# EAGLE schematic msp430f5528 (EAGLE 6.6.0)
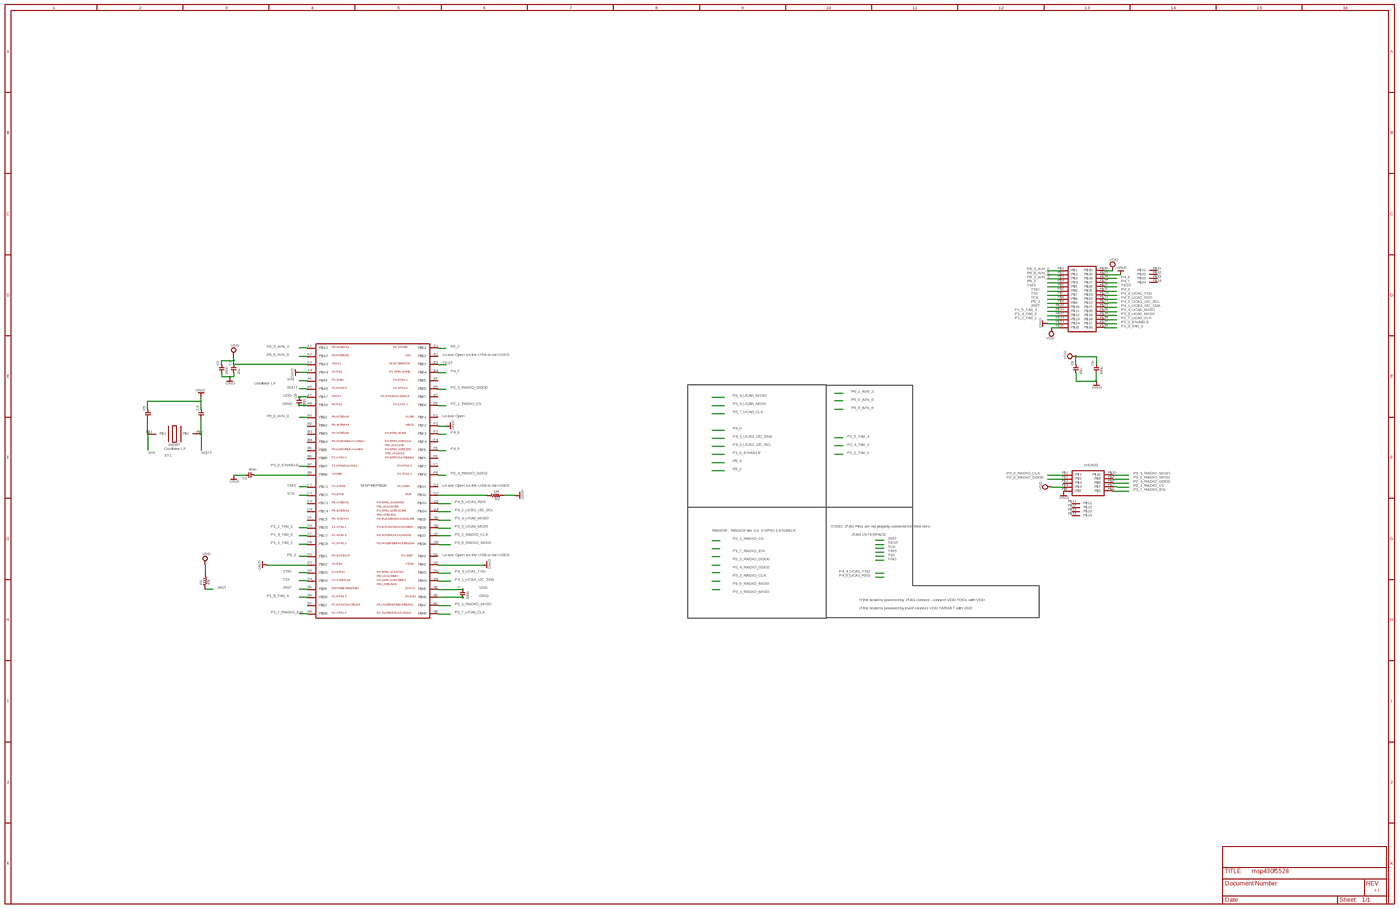
[diagram p0: schematic, sheet 1, overview]
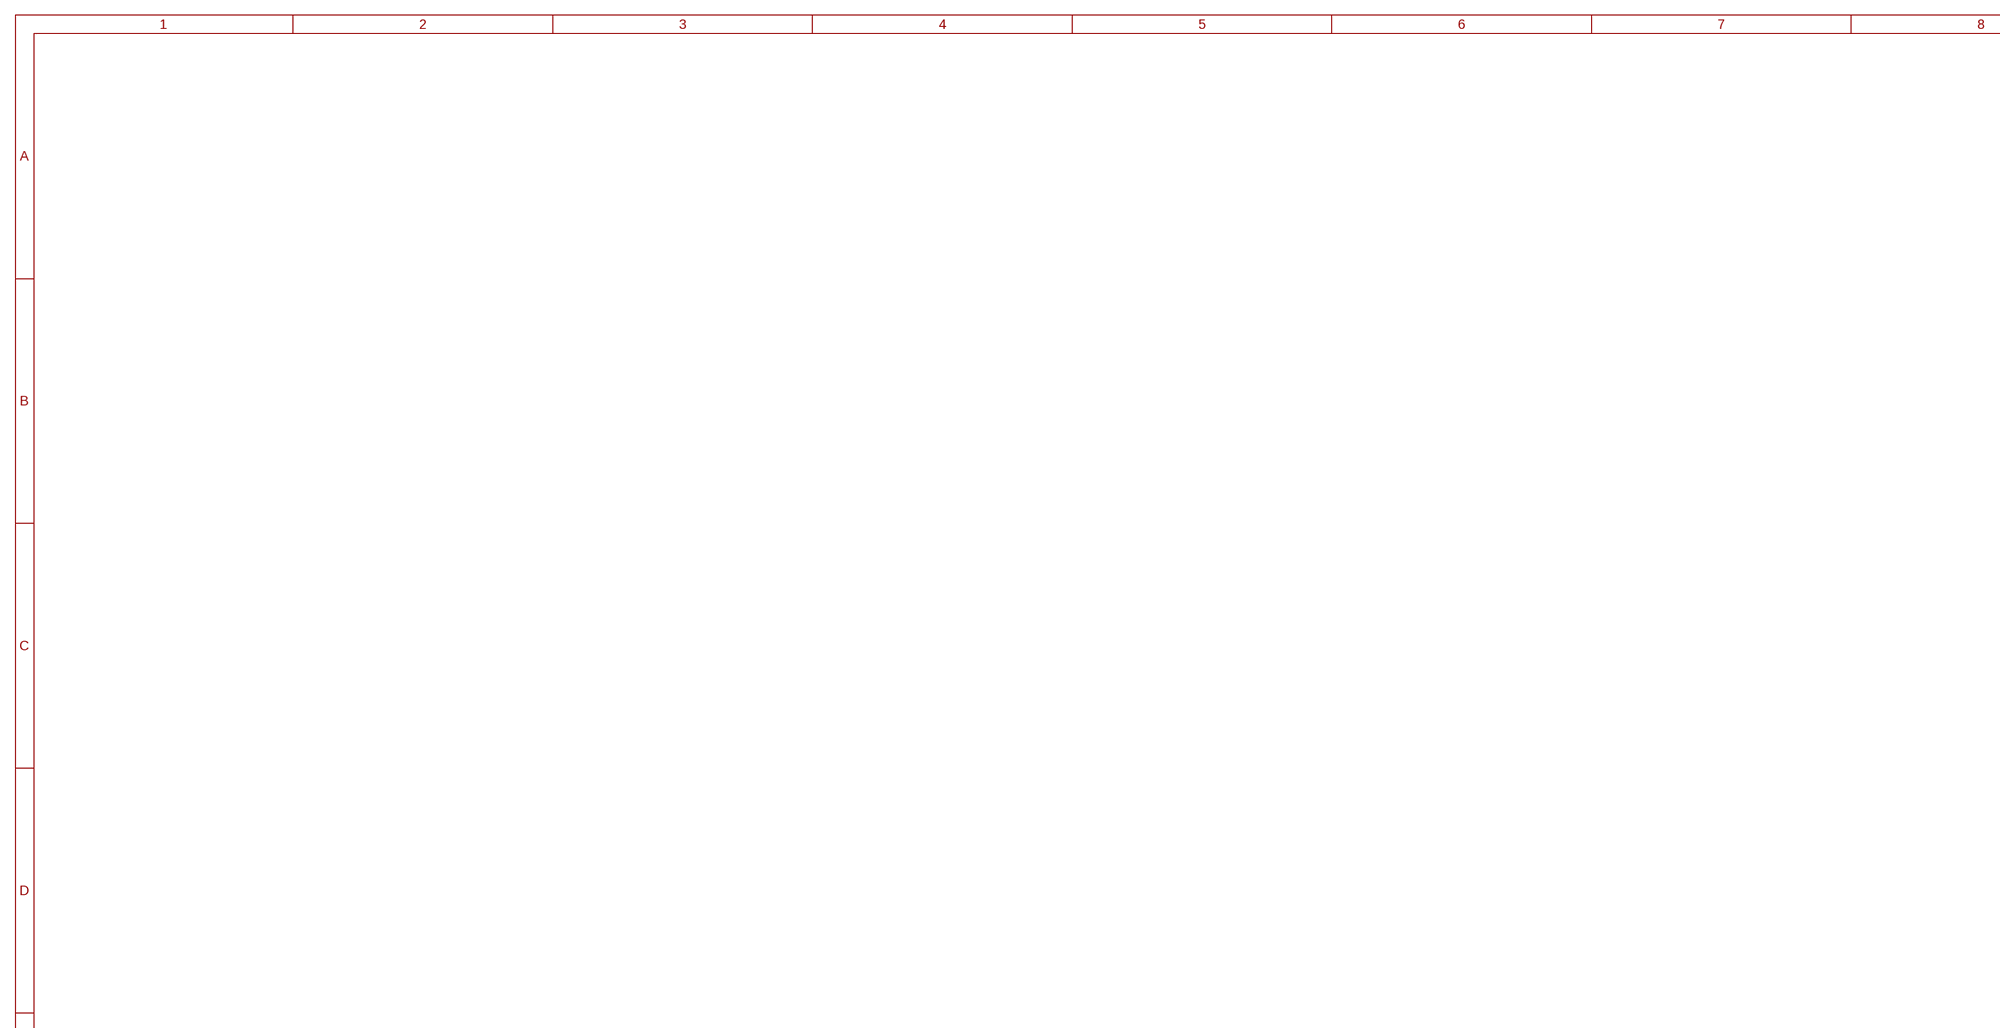
[diagram p1: schematic, sheet 1, part 1 of 4]
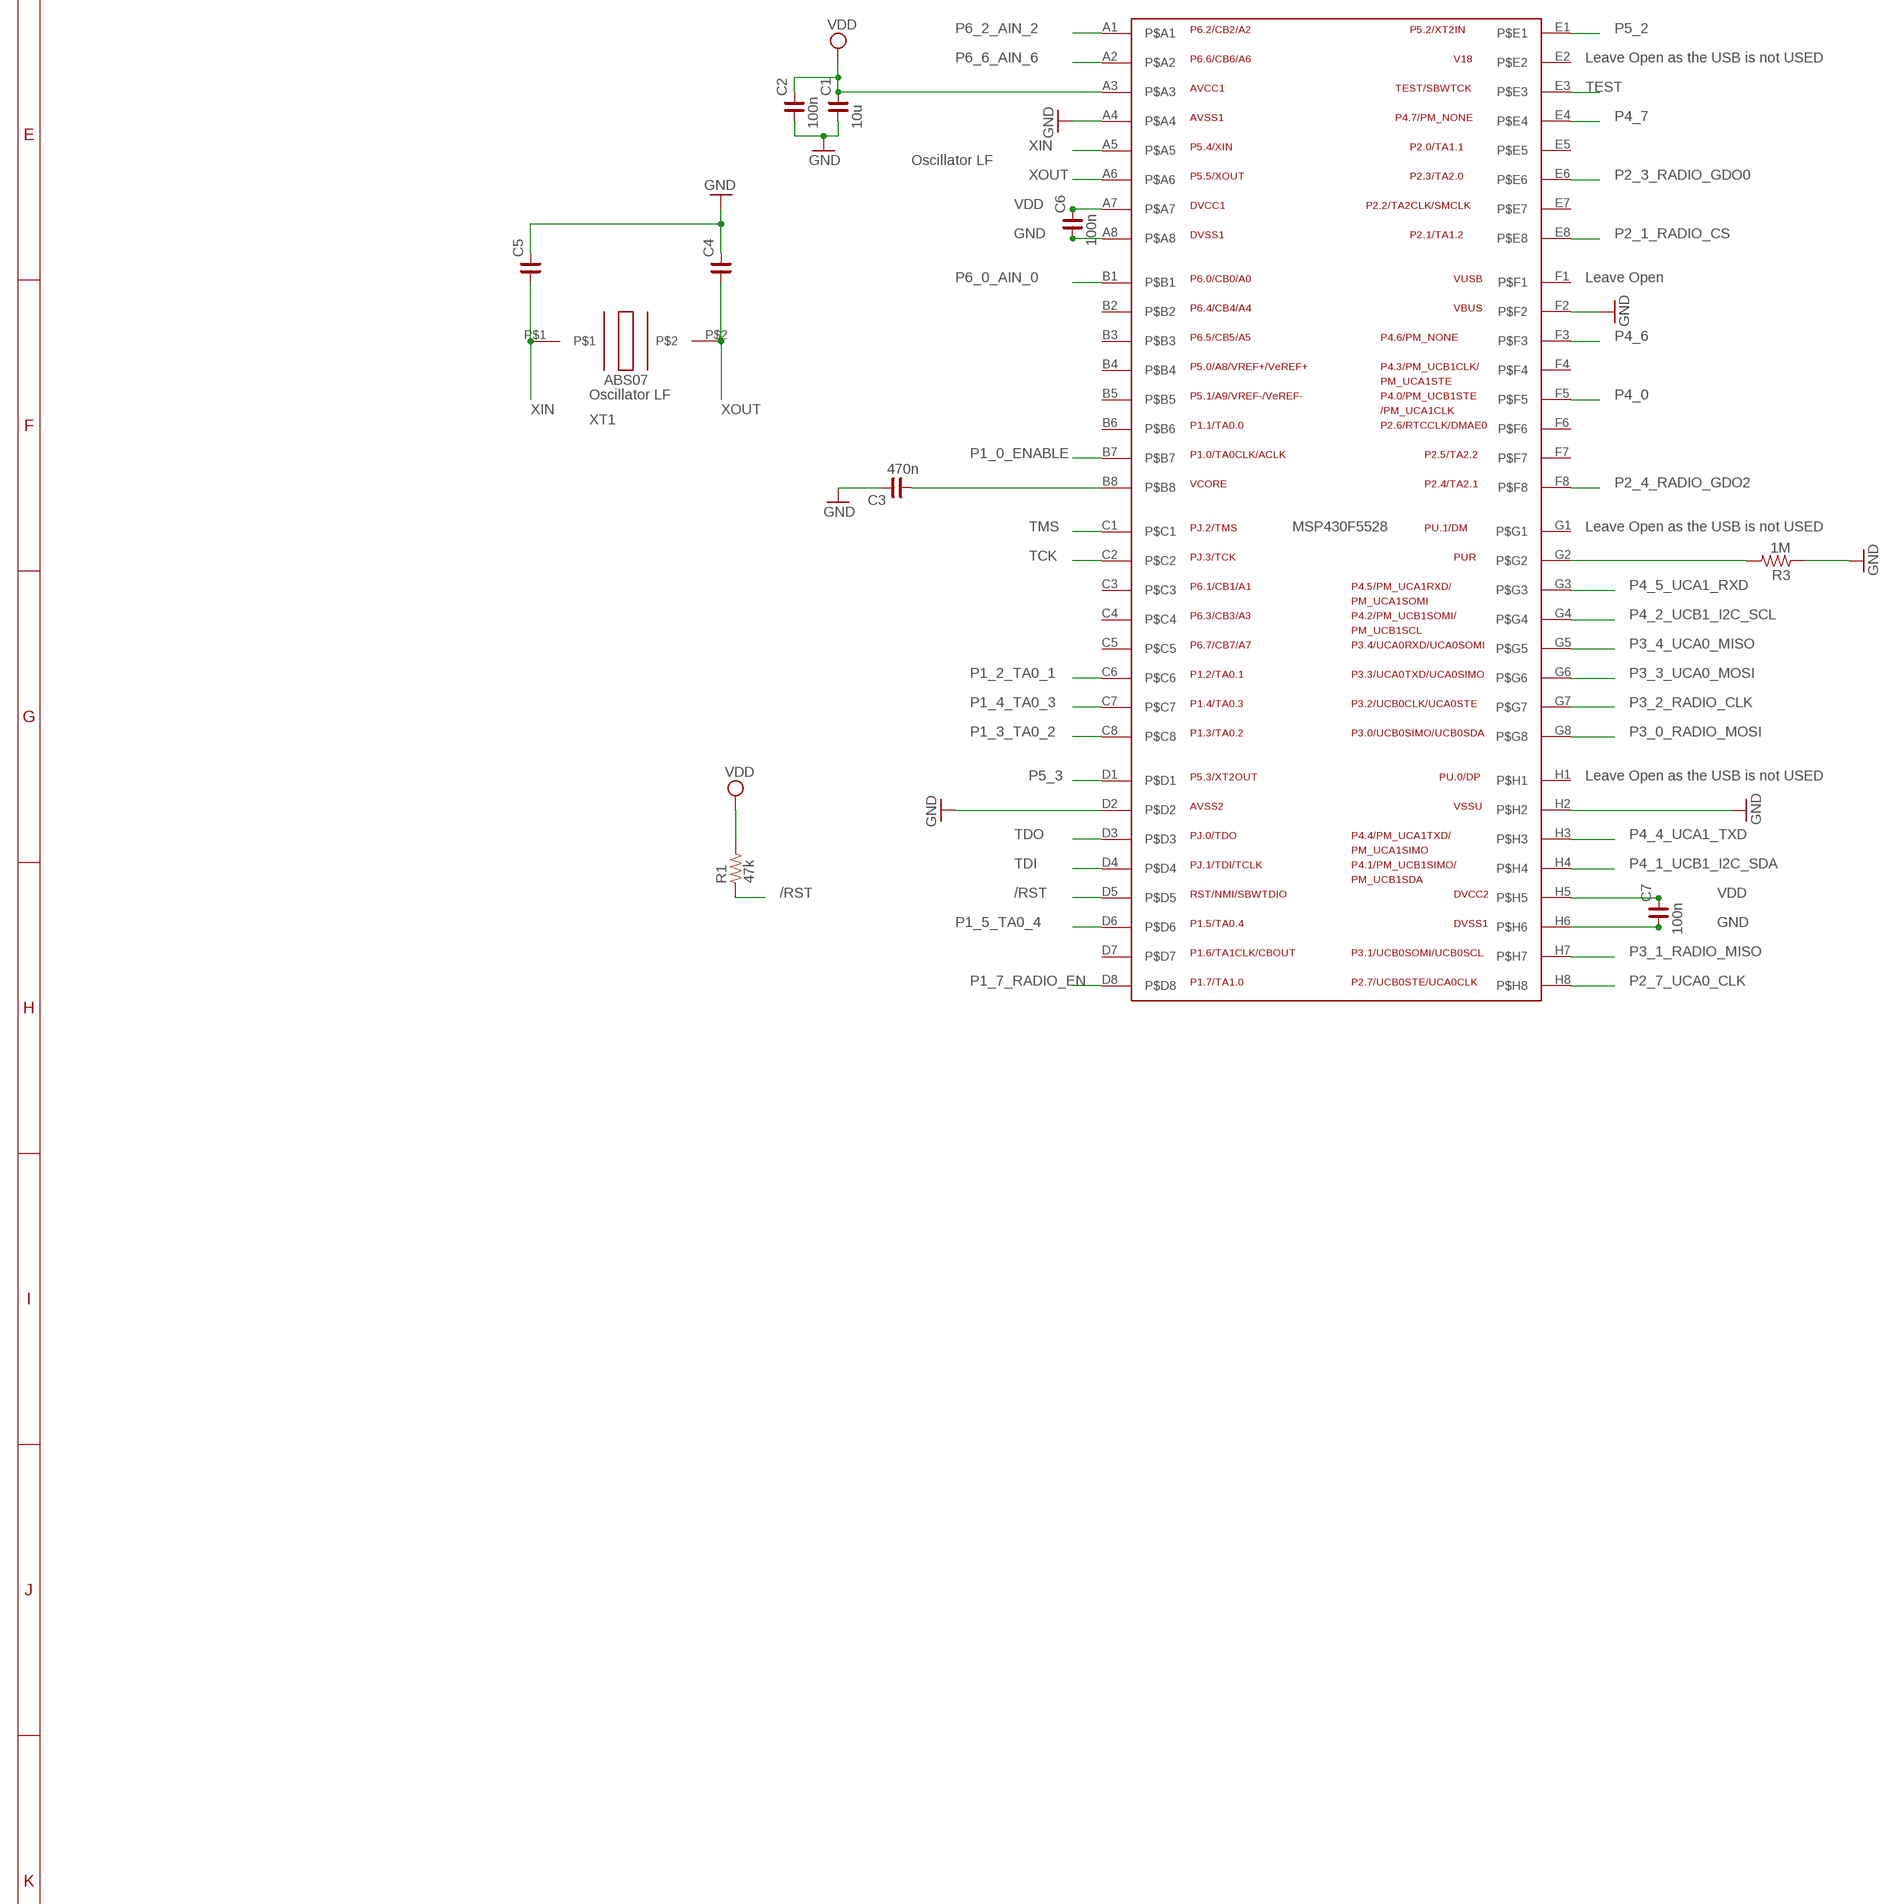
[diagram p2: schematic, sheet 1, part 2 of 4]
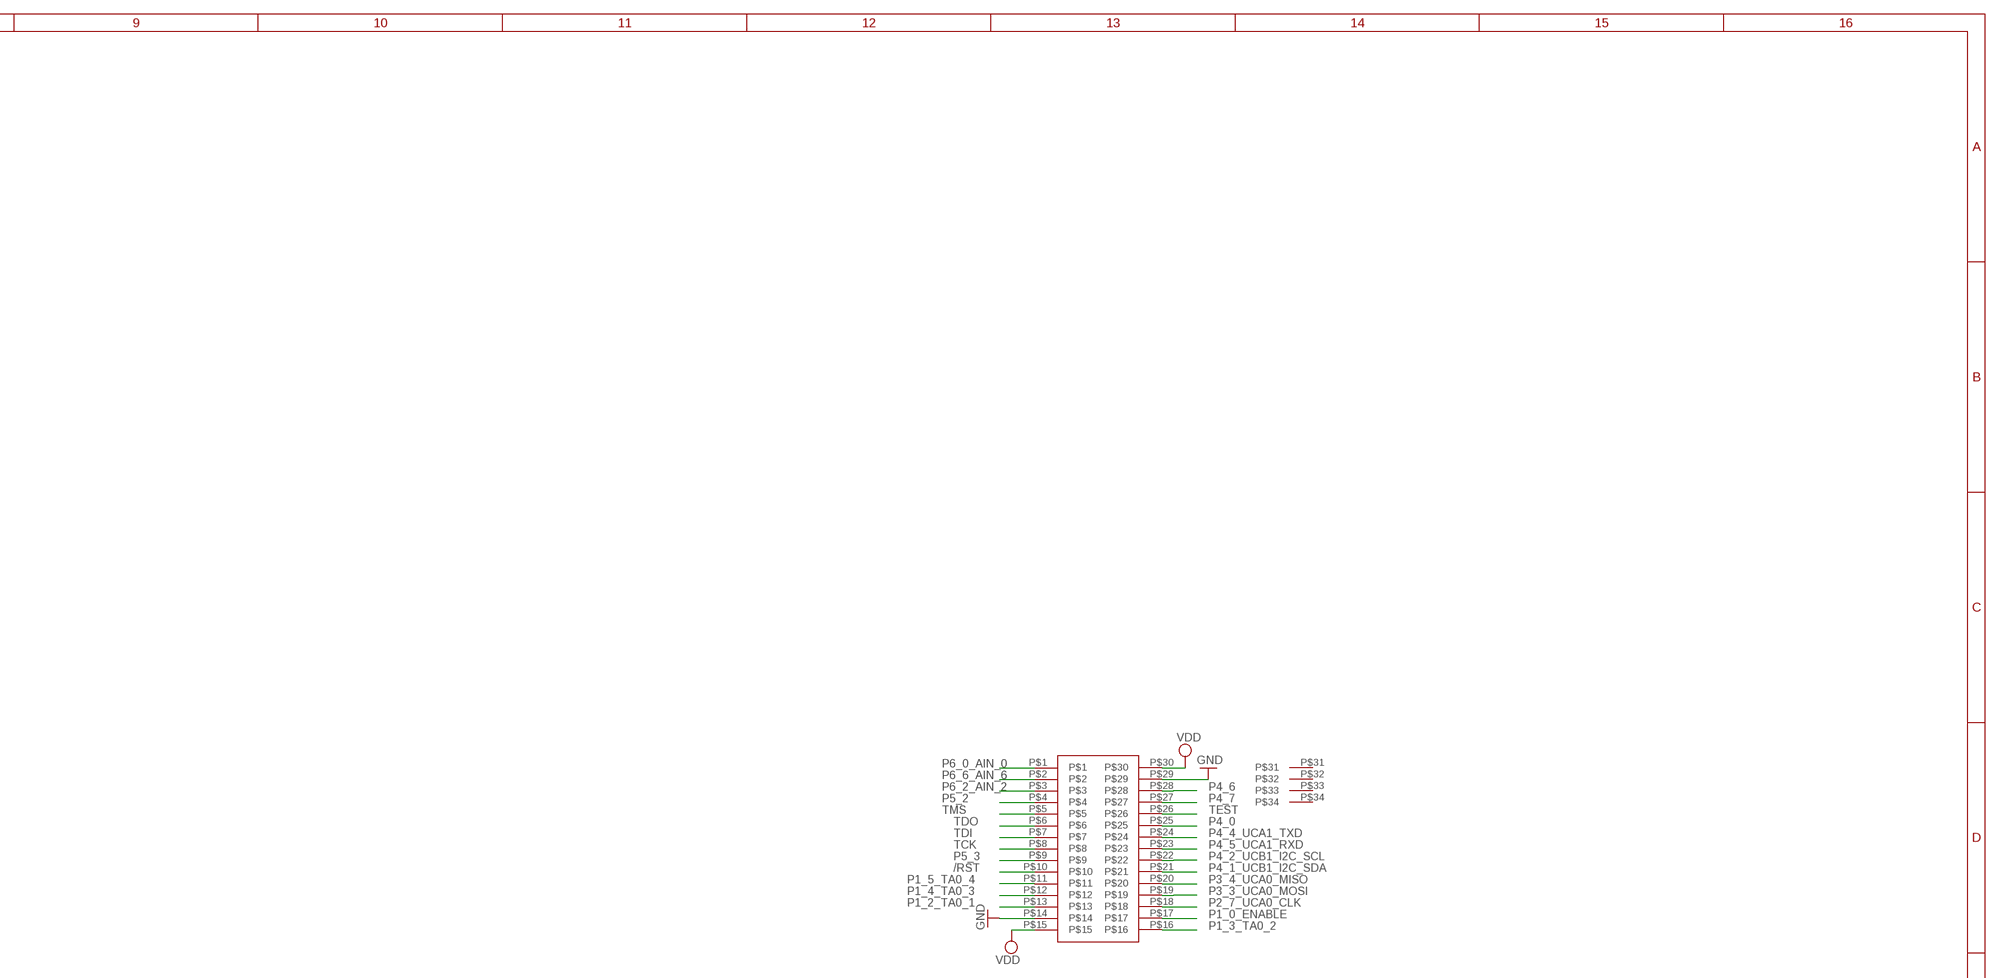
[diagram p3: schematic, sheet 1, part 3 of 4]
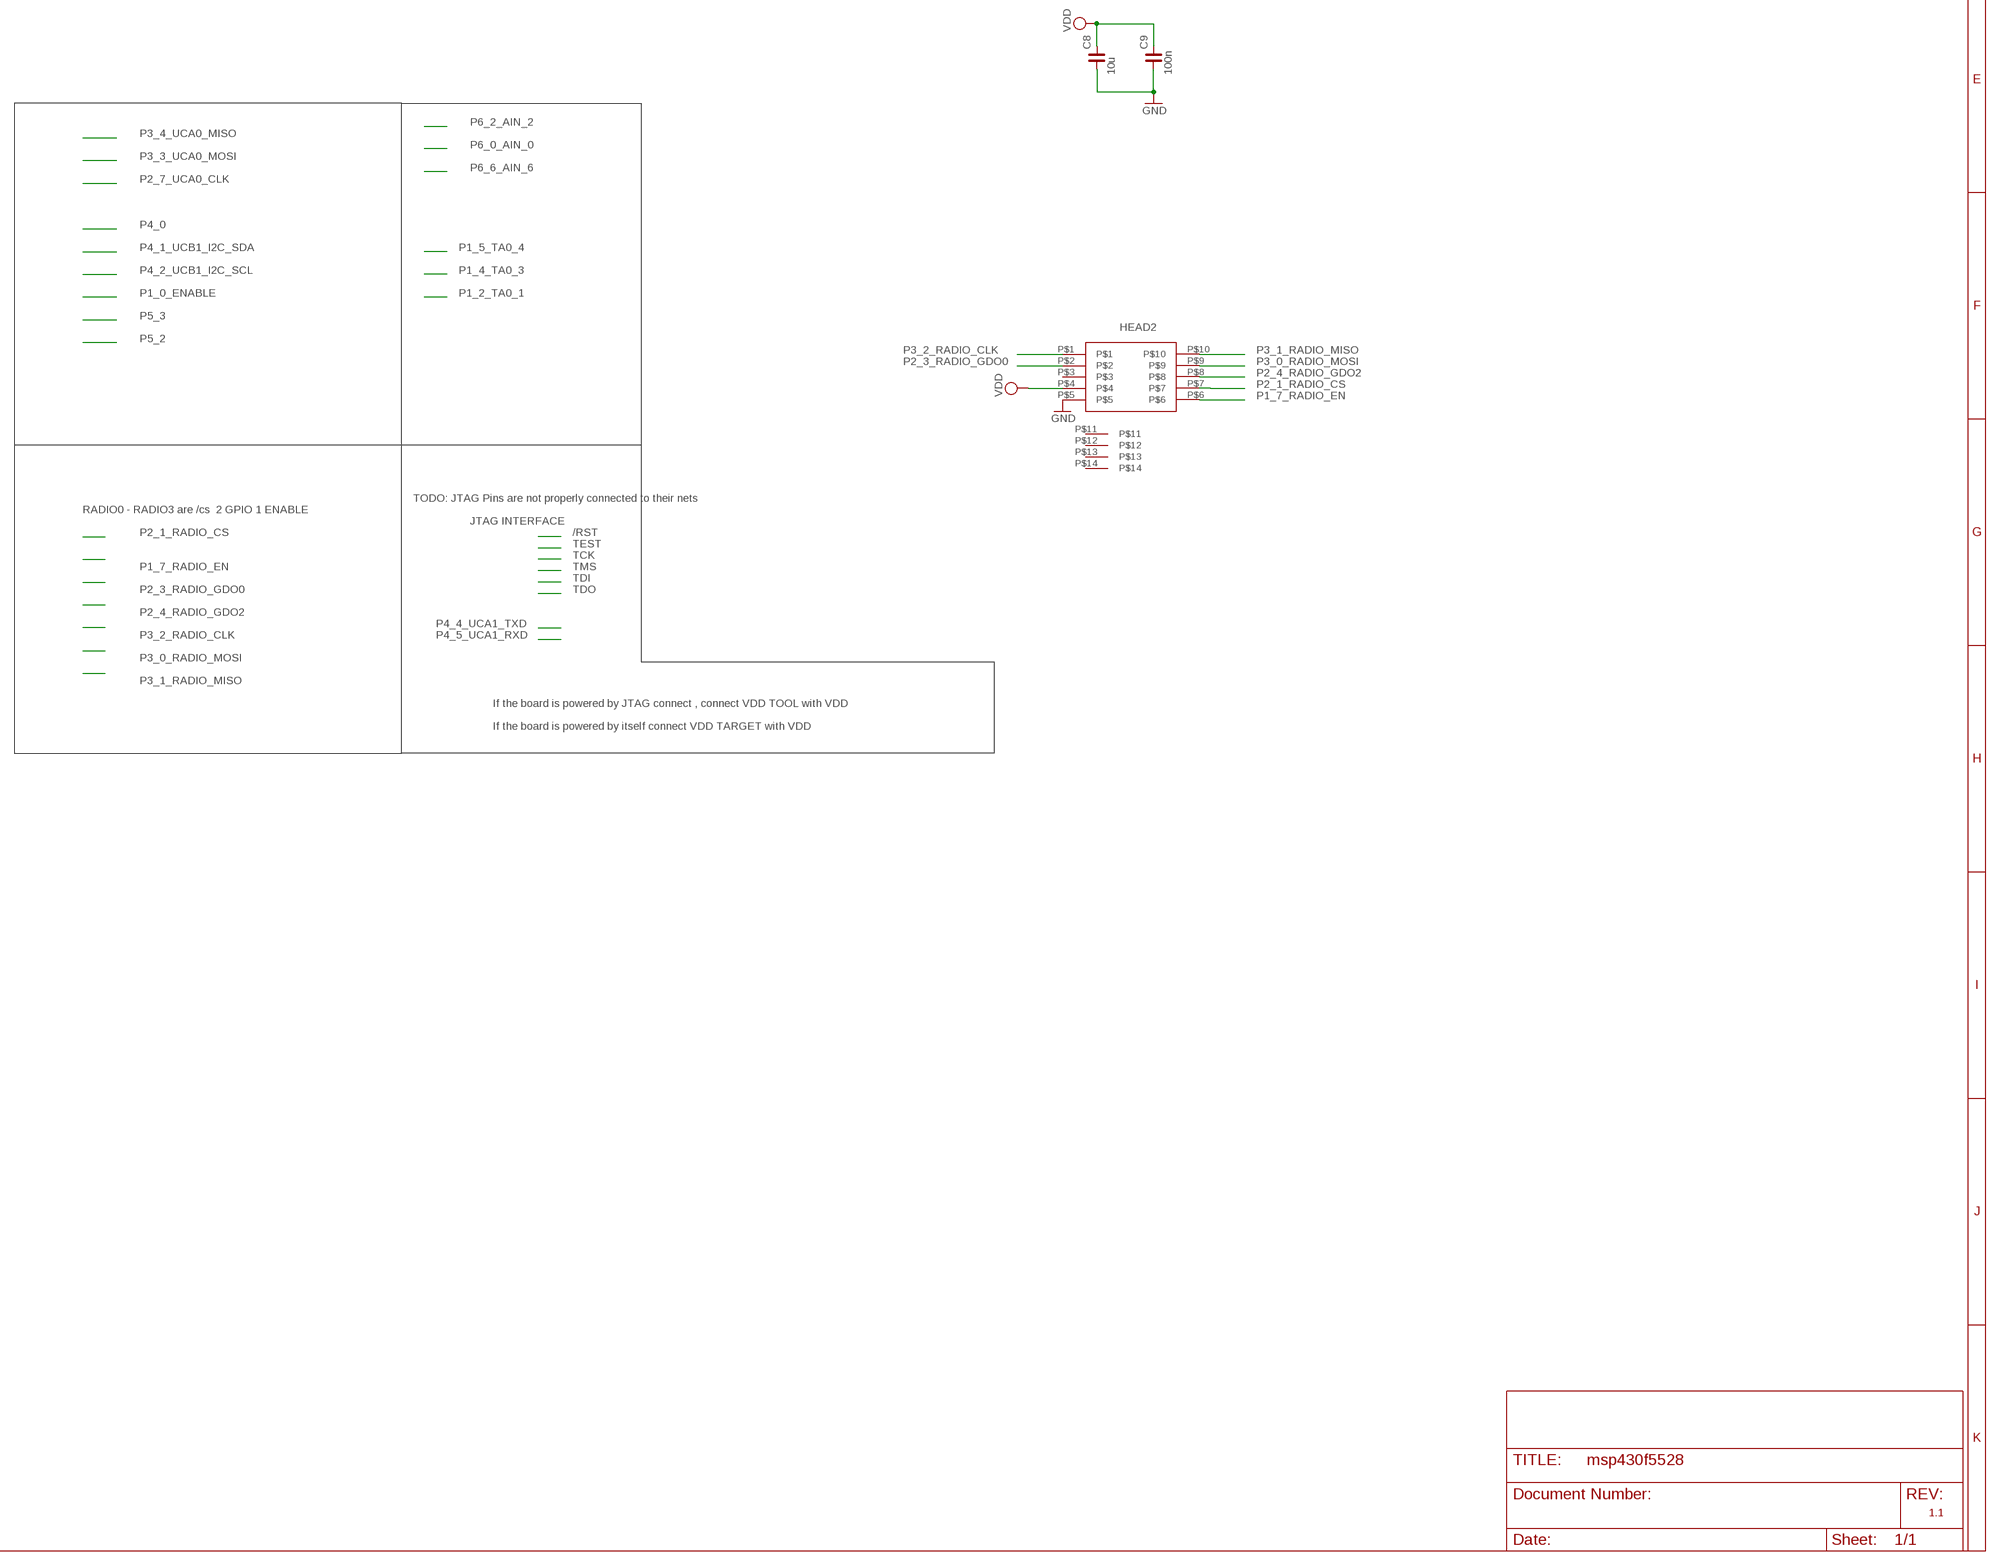
[diagram p4: schematic, sheet 1, part 4 of 4]

## Parts
C1  10u  C_0402  [C0402]
C2  100n  C_0402  [C0402]
C3  470n  C_0402  [C0402]
C4  C_0402  [C0402]
C5  C_0402  [C0402]
C6  100n  C_0402  [C0402]
C7  100n  C_0402  [C0402]
C8  10u  C_0402  [C0402]
C9  100n  C_0402  [C0402]
R1  47k  R_0402  [R0402]
R3  1M  R_0402  [R0402]
U$1  MSP430F5528  [YFF64]
U$2  OSC32K  [ABS07]
U$4  55909-0374_PLUG  [55909-0374_PLUG]
U$5  559099872_2X5_PLUG  [559099872_2X5_PLUG]

## Nets
/RST: R1.1 U$1.D5(P$D5) U$4.P$10
GND: C1.1 C2.1 C3.2 C4.2 C5.2 C6.1 C7.1 C8.1 C9.1 R3.1 U$1.A4(P$A4) U$1.A8(P$A8) U$1.D2(P$D2) U$1.F2(P$F2) U$1.H2(P$H2) U$1.H6(P$H6) U$4.P$14 U$4.P$29 U$5.P$5
N$3: C3.1 U$1.B8(P$B8)
N$29: R3.2 U$1.G2(P$G2)
P1_0_ENABLE: U$1.B7(P$B7) U$4.P$17
P1_2_TA0_1: U$1.C6(P$C6) U$4.P$13
P1_3_TA0_2: U$1.C8(P$C8) U$4.P$16
P1_4_TA0_3: U$1.C7(P$C7) U$4.P$12
P1_5_TA0_4: U$1.D6(P$D6) U$4.P$11
P1_7_RADIO_EN: U$1.D8(P$D8) U$5.P$6
P2_1_RADIO_CS: U$1.E8(P$E8) U$5.P$7
P2_3_RADIO_GDO0: U$1.E6(P$E6) U$5.P$2
P2_4_RADIO_GDO2: U$1.F8(P$F8) U$5.P$8
P2_7_UCA0_CLK: U$1.H8(P$H8) U$4.P$18
P3_0_RADIO_MOSI: U$1.G8(P$G8) U$5.P$9
P3_1_RADIO_MISO: U$1.H7(P$H7) U$5.P$10
P3_2_RADIO_CLK: U$1.G7(P$G7) U$5.P$1
P3_3_UCA0_MOSI: U$1.G6(P$G6) U$4.P$19
P3_4_UCA0_MISO: U$1.G5(P$G5) U$4.P$20
P4_0: U$1.F5(P$F5) U$4.P$25
P4_1_UCB1_I2C_SDA: U$1.H4(P$H4) U$4.P$21
P4_2_UCB1_I2C_SCL: U$1.G4(P$G4) U$4.P$22
P4_4_UCA1_TXD: U$1.H3(P$H3) U$4.P$24
P4_5_UCA1_RXD: U$1.G3(P$G3) U$4.P$23
P4_6: U$1.F3(P$F3) U$4.P$28
P4_7: U$1.E4(P$E4) U$4.P$27
P5_2: U$1.E1(P$E1) U$4.P$4
P5_3: U$1.D1(P$D1) U$4.P$9
P6_0_AIN_0: U$1.B1(P$B1) U$4.P$1
P6_2_AIN_2: U$1.A1(P$A1) U$4.P$3
P6_6_AIN_6: U$1.A2(P$A2) U$4.P$2
TCK: U$1.C2(P$C2) U$4.P$8
TDI: U$1.D4(P$D4) U$4.P$7
TDO: U$1.D3(P$D3) U$4.P$6
TEST: U$1.E3(P$E3) U$4.P$26
TMS: U$1.C1(P$C1) U$4.P$5
VDD: C1.2 C2.2 C6.2 C7.2 C8.2 C9.2 R1.2 U$1.A3(P$A3) U$1.A7(P$A7) U$1.H5(P$H5) U$4.P$15 U$4.P$30 U$5.P$4
XIN: C5.1 U$1.A5(P$A5) U$2.P$1
XOUT: C4.1 U$1.A6(P$A6) U$2.P$2
Unconnected: U$1.B2(P$B2) U$1.B3(P$B3) U$1.B4(P$B4) U$1.B5(P$B5) U$1.B6(P$B6) U$1.C3(P$C3) U$1.C4(P$C4) U$1.C5(P$C5) U$1.D7(P$D7) U$1.E2(P$E2) U$1.E5(P$E5) U$1.E7(P$E7) U$1.F1(P$F1) U$1.F4(P$F4) U$1.F6(P$F6) U$1.F7(P$F7) U$1.G1(P$G1) U$1.H1(P$H1) U$4.P$31 U$4.P$32 U$4.P$33 U$4.P$34 U$5.P$3 U$5.P$11 U$5.P$12 U$5.P$13 U$5.P$14

## Notes on the sheet
- Leave Open as the USB is not USED
- Oscillator LF
- Leave Open
- Oscillator LF
- XT1
- HEAD2
- Leave Open as the USB is not USED
- TODO: JTAG Pins are not properly connected to their nets
- RADIO0 - RADIO3 are /cs  2 GPIO 1 ENABLE
- JTAG INTERFACE
- Leave Open as the USB is not USED
- If the board is powered by JTAG connect , connect VDD TOOL with VDD
- If the board is powered by itself connect VDD TARGET with VDD
- 1.1

## Library data of the parts
C1-C9 = rc-master-smd:C_: NON-POLARIZED CAP
R1 R3 = rc-master-smd:R_: RESISTOR
U$1 = msp430f5528:MSP430F5528
U$2 = ABS07:OSC32K; PARTNUMBER: 5359801-ND; VENDOR: DK
U$4 = Molex_SlimStack:55909-0374_PLUG: 55909-0374_PLUG MOLEX; VENDOR: DK
U$5 = Molex_SlimStack:559099872_2X5_PLUG